# Altium schematic sheet SPE_Electronics.SchDoc
size A4; SheetNumber: 5; SheetTotal: 5
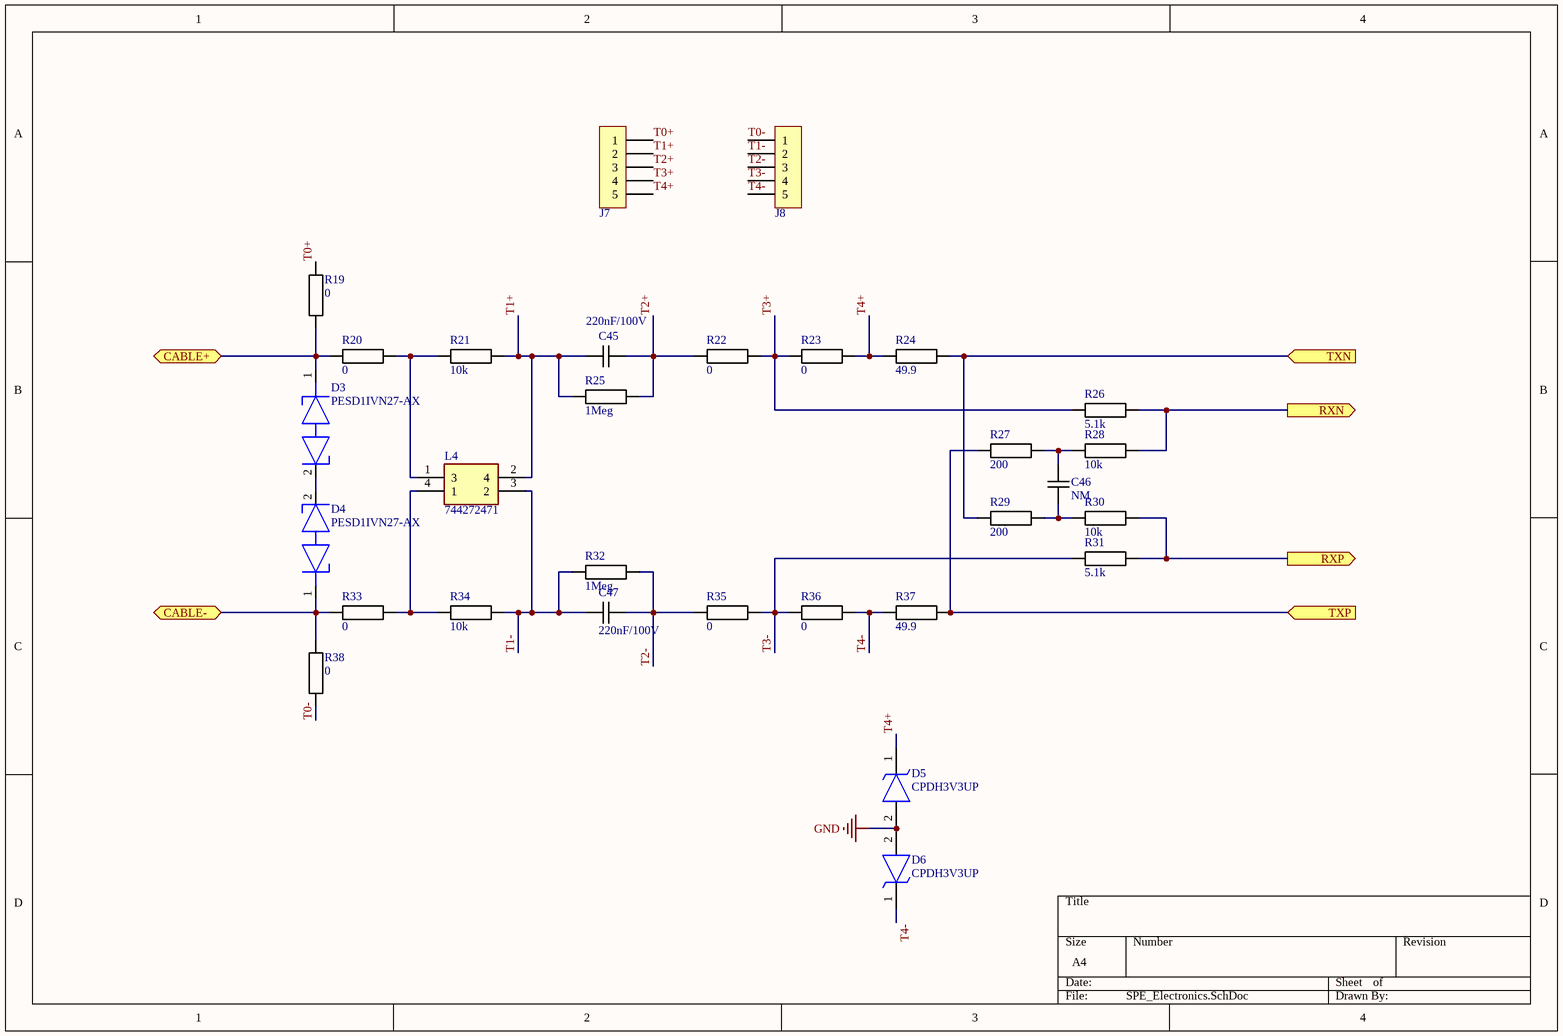
[diagram p0: SPE_Electronics.SchDoc]

## Parts
C45  220nF/100V  [CAPACITOR 1608 REFLOW]
C46  NM  [CAPACITOR 1608 REFLOW]
C47  220nF/100V  [CAPACITOR 1608 REFLOW]
D3  PESD1IVN27-AX  [PESD1IVN27AX]
D4  PESD1IVN27-AX  [PESD1IVN27AX]
D5  CPDH3V3UP  [CPDH3V3UP]
D6  CPDH3V3UP  [CPDH3V3UP]
J7  *  [PinHeader1x5 P2.54]  (value not drawn)
J8  *  [PinHeader1x5 P2.54]  (value not drawn)
L4  744272471  [WE-SL575]
R19  0  [RESISTOR 1608 REFLOW]
R20  0  [RESISTOR 1608 REFLOW]
R21  10k  [RESISTOR 1608 REFLOW]
R22  0  [RESISTOR 1608 REFLOW]
R23  0  [RESISTOR 1608 REFLOW]
R24  49.9  [RESISTOR 1608 REFLOW]
R25  1Meg  [RESISTOR 1608 REFLOW]
R26  5.1k  [RESISTOR 1608 REFLOW]
R27  200  [RESISTOR 1608 REFLOW]
R28  10k  [RESISTOR 1608 REFLOW]
R29  200  [RESISTOR 1608 REFLOW]
R30  10k  [RESISTOR 1608 REFLOW]
R31  5.1k  [RESISTOR 1608 REFLOW]
R32  1Meg  [RESISTOR 1608 REFLOW]
R33  0  [RESISTOR 1608 REFLOW]
R34  10k  [RESISTOR 1608 REFLOW]
R35  0  [RESISTOR 1608 REFLOW]
R36  0  [RESISTOR 1608 REFLOW]
R37  49.9  [RESISTOR 1608 REFLOW]
R38  0  [RESISTOR 1608 REFLOW]

## Ports
CABLE+ (bidir), CABLE- (bidir), RXN (out), RXP (out), TXN (in), TXP (in)

## Nets
GND: D5.2(A) D6.2(A)
CABLE+: D3.1(K1) R19.2 R20.2 ; port CABLE+
CABLE-: D4.1(K1) R33.2 R38.2 ; port CABLE-
RXN: R26.1 R28.1 ; port RXN
RXP: R30.1 R31.1 ; port RXP
T0+: J7.1 R19.1
T0-: J8.1 R38.1
T1+: C45.2 J7.2 L4.2(4) R21.1 R25.2
T1-: C47.2 J8.2 L4.3(2) R32.2 R34.1
T2+: C45.1 J7.3 R22.2 R25.1
T2-: C47.1 J8.3 R32.1 R35.2
T3+: J7.4 R22.1 R23.2 R26.2
T3-: J8.4 R31.2 R35.1 R36.2
T4+: D5.1(K) J7.5 R23.1 R24.2
T4-: D6.1(K) J8.5 R36.1 R37.2
TXN: R24.1 R29.2 ; port TXN
TXP: R27.2 R37.1 ; port TXP
NetC46_1: C46.1 R29.1 R30.2
NetC46_2: C46.2 R27.1 R28.2
NetD3_2: D3.2(K2) D4.2(K2)
NetL4_1: L4.1(3) R20.1 R21.2
NetL4_4: L4.4(1) R33.1 R34.2

## Library data of the parts
C45-C47 = Capacitor
  C45 C47: Value: 220nF/100V
  C46: Value: NM
D3 D4 = PESD1IVN27-AX: Diode ESD (Bi-directional); Manufacturer_Name: Nexperia; Datasheet Link: https://assets.nexperia.com/documents/data-sheet/PESD1IVN27-A.pdf; Height: 1.1mm; Manufacturer_Part_Number: PESD1IVN27-AX; Mouser Part Number: 771-PESD1IVN27-AX; Mouser Price/Stock: https://www.mouser.co.uk/ProductDetail/Nexperia/PESD1IVN27-AX?qs=0lQeLiL1qyYTtxrCfdJstQ%3D%3D; Arrow Part Number: PESD1IVN27-AX; Arrow Price/Stock: https://www.arrow.com/en/products/pesd1ivn27-ax/nexperia
D5 D6 = CPDH3V3UP: TVS Diode (Uni-directional); Manufacturer_Name: Comchip Technology; Datasheet Link: https://datasheet.datasheetarchive.com/originals/distributors/Datasheets-DGA26/1846145.pdf; Height: 0.77mm; Manufacturer_Part_Number: CPDH3V3UP; Mouser Part Number: 750-CPDH3V3UP; Mouser Price/Stock: https://www.mouser.co.uk/ProductDetail/Comchip-Technology/CPDH3V3UP?qs=tw%252BuQ%2FB6PO1cIMMFw61gpA%3D%3D; Arrow Part Number: CPDH3V3UP; Arrow Price/Stock: https://www.arrow.com/en/products/cpdh3v3up/comchip-technology
J7 J8 = PinHeader1x5: Plug connector; Value: *
L4 = 744272471: Inductor; Manufacturer_Name: Wurth Elektronik; Manufacturer_Part_Number: 744272471; Mouser Part Number: 710-744272471; Mouser Price/Stock: https://www.mouser.co.uk/ProductDetail/Wurth-Elektronik/744272471?qs=PGXP4M47uW4cnUBvOIMCOQ%3D%3D
R19-R38 = Resistor
  R19 R20 R22 R23 R33 R35 R36 R38: Value: 0
  R21 R28 R30 R34: Value: 10k
  R24 R37: Value: 49.9
  R25 R32: Value: 1Meg
  R26 R31: Value: 5.1k
  R27 R29: Value: 200